# EAGLE design schematic_e01 (EAGLE 5.09)
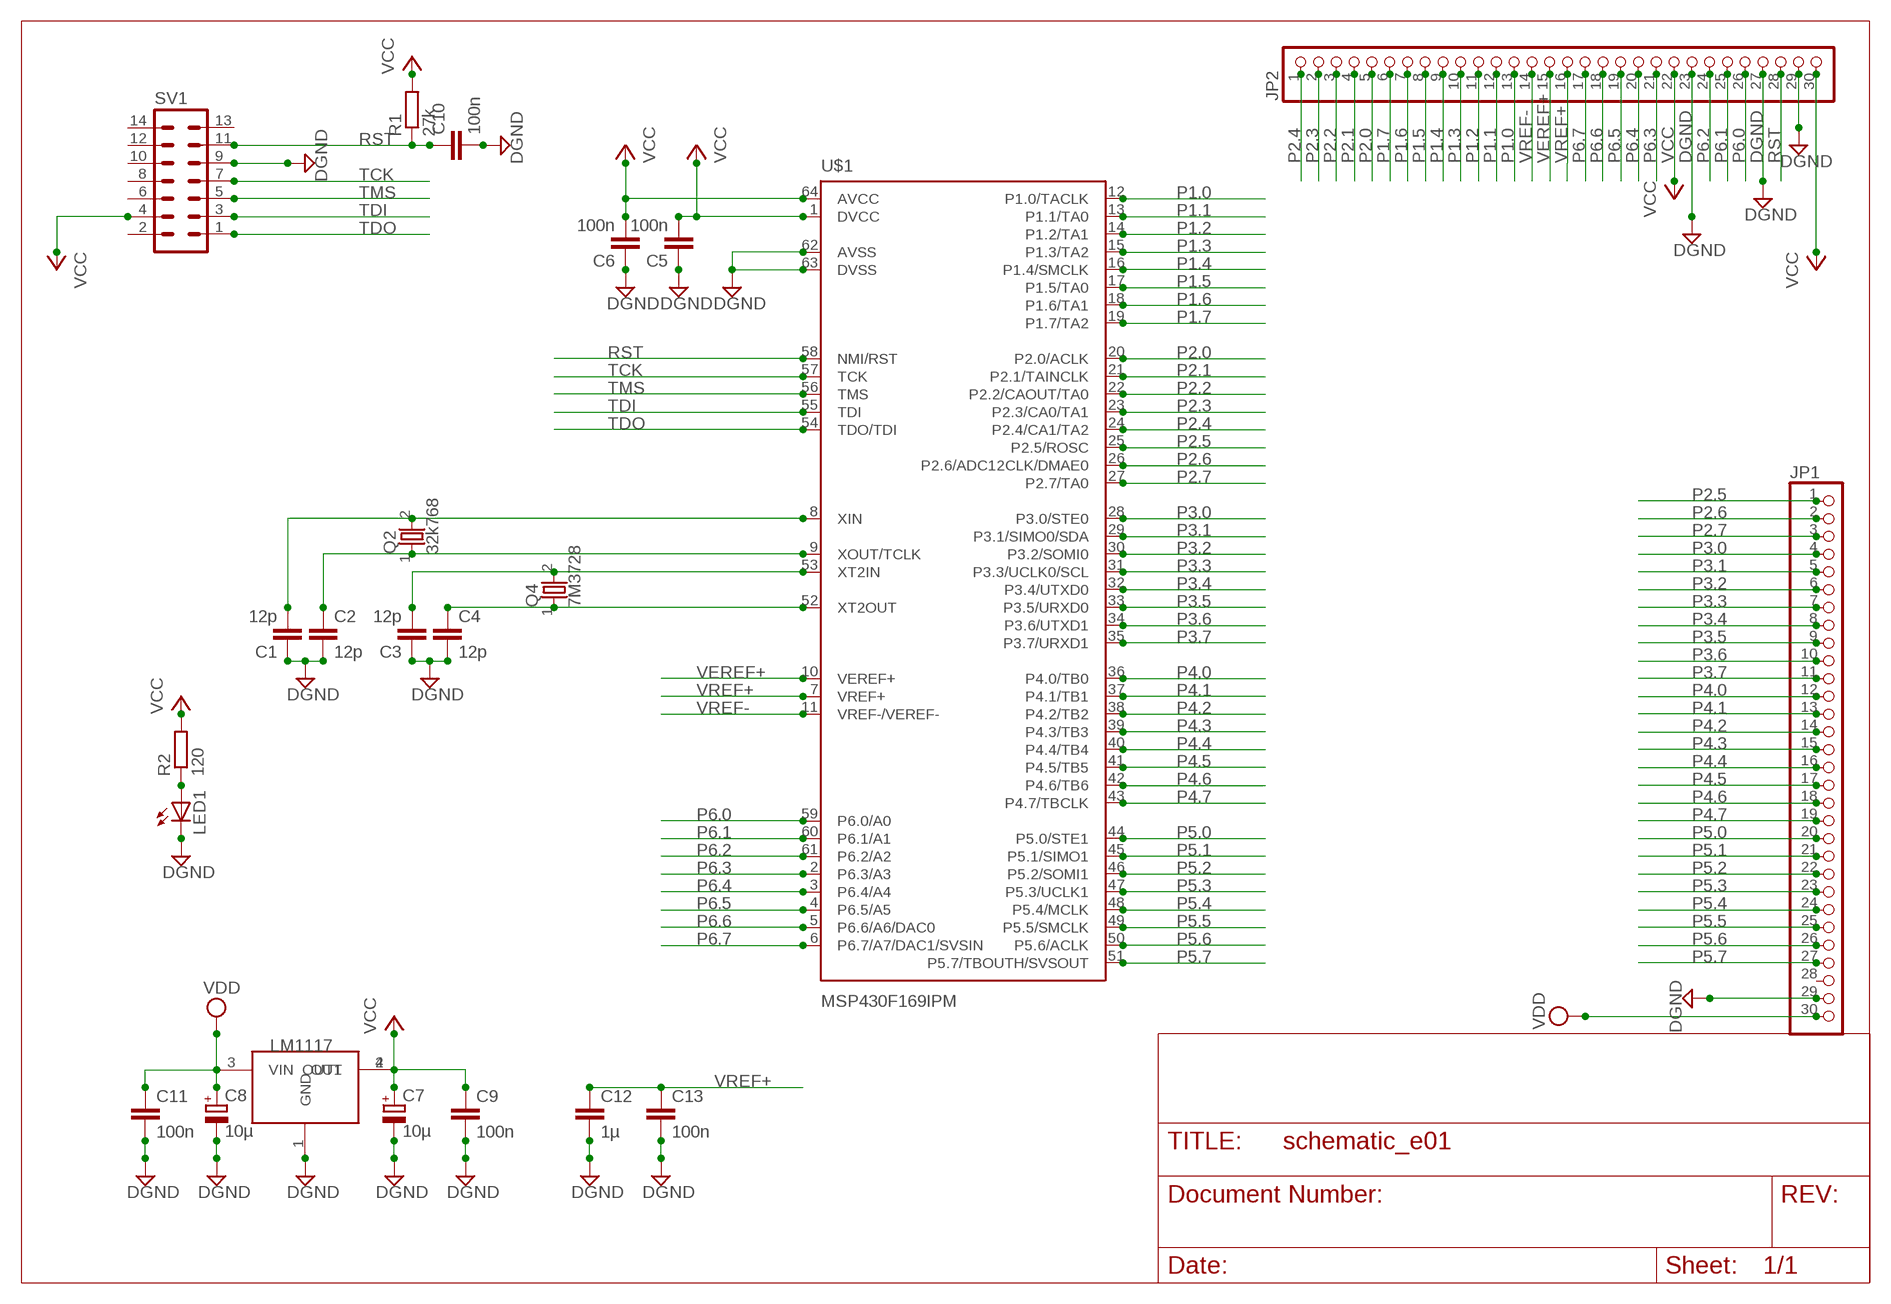
[diagram p0: schematic, sheet 1]

## Parts
C1  12p  C-EUC0805  [C0805]
C2  12p  C-EUC0805  [C0805]
C3  12p  C-EUC0805  [C0805]
C4  12p  C-EUC0805  [C0805]
C5  100n  C-EUC0805  [C0805]
C6  100n  C-EUC0805  [C0805]
C7  10µ  CPOL-EU153CLV-0505  [153CLV-0505]
C8  10µ  CPOL-EU153CLV-0505  [153CLV-0505]
C9  100n  C-EUC0805  [C0805]
C10  100n  C-EUC0805  [C0805]
C11  100n  C-EUC0805  [C0805]
C12  1µ  C-EUC0805  [C0805]
C13  100n  C-EUC0805  [C0805]
IC1  LM1117  [SOT223]
JP1  PINHD-1X30  [1X30]
JP2  PINHD-1X30  [1X30]
LED1  LEDP-LCC-2  [P-LCC-2]
Q2  32k768  MC406  [MC406]
Q4  7M3728  FA-365  [FA-365]
R1  27k  R-EU_R1206  [R1206]
R2  120  R-EU_R0805  [R0805]
SV1  ML14  [ML14]
U$1  MSP430F169IPM  [S-PQFP64-G64]

## Nets
DGND: C1.1 C2.2 C3.1 C4.2 C5.1 C6.1 C7.- C8.- C9.2 C10.2 C11.2 C12.2 C13.2 IC1.1(GND) JP1.29 JP2.23 JP2.27 JP2.29 LED1.C SV1.9 U$1.62(AVSS) U$1.63(DVSS)
N$1: C1.2 Q2.2 U$1.8(XIN)
N$2: C2.1 Q2.1 U$1.9(XOUT/TCLK)
N$3: C3.2 Q4.2 U$1.53(XT2IN)
N$4: C4.1 Q4.1 U$1.52(XT2OUT)
N$6: LED1.A R2.1
P1.0: JP2.13 U$1.12(P1.0/TACLK)
P1.1: JP2.12 U$1.13(P1.1/TA0)
P1.2: JP2.11 U$1.14(P1.2/TA1)
P1.3: JP2.10 U$1.15(P1.3/TA2)
P1.4: JP2.9 U$1.16(P1.4/SMCLK)
P1.5: JP2.8 U$1.17(P1.5/TA0)
P1.6: JP2.7 U$1.18(P1.6/TA1)
P1.7: JP2.6 U$1.19(P1.7/TA2)
P2.0: JP2.5 U$1.20(P2.0/ACLK)
P2.1: JP2.4 U$1.21(P2.1/TAINCLK)
P2.2: JP2.3 U$1.22(P2.2/CAOUT/TA0)
P2.3: JP2.2 U$1.23(P2.3/CA0/TA1)
P2.4: JP2.1 U$1.24(P2.4/CA1/TA2)
P2.5: JP1.1 U$1.25(P2.5/ROSC)
P2.6: JP1.2 U$1.26(P2.6/ADC12CLK/DMAE0)
P2.7: JP1.3 U$1.27(P2.7/TA0)
P3.0: JP1.4 U$1.28(P3.0/STE0)
P3.1: JP1.5 U$1.29(P3.1/SIMO0/SDA)
P3.2: JP1.6 U$1.30(P3.2/SOMI0)
P3.3: JP1.7 U$1.31(P3.3/UCLK0/SCL)
P3.4: JP1.8 U$1.32(P3.4/UTXD0)
P3.5: JP1.9 U$1.33(P3.5/URXD0)
P3.6: JP1.10 U$1.34(P3.6/UTXD1)
P3.7: JP1.11 U$1.35(P3.7/URXD1)
P4.0: JP1.12 U$1.36(P4.0/TB0)
P4.1: JP1.13 U$1.37(P4.1/TB1)
P4.2: JP1.14 U$1.38(P4.2/TB2)
P4.3: JP1.15 U$1.39(P4.3/TB3)
P4.4: JP1.16 U$1.40(P4.4/TB4)
P4.5: JP1.17 U$1.41(P4.5/TB5)
P4.6: JP1.18 U$1.42(P4.6/TB6)
P4.7: JP1.19 U$1.43(P4.7/TBCLK)
P5.0: JP1.20 U$1.44(P5.0/STE1)
P5.1: JP1.21 U$1.45(P5.1/SIMO1)
P5.2: JP1.22 U$1.46(P5.2/SOMI1)
P5.3: JP1.23 U$1.47(P5.3/UCLK1)
P5.4: JP1.24 U$1.48(P5.4/MCLK)
P5.5: JP1.25 U$1.49(P5.5/SMCLK)
P5.6: JP1.26 U$1.50(P5.6/ACLK)
P5.7: JP1.27 U$1.51(P5.7/TBOUTH/SVSOUT)
P6.0: JP2.26 U$1.59(P6.0/A0)
P6.1: JP2.25 U$1.60(P6.1/A1)
P6.2: JP2.24 U$1.61(P6.2/A2)
P6.3: JP2.21 U$1.2(P6.3/A3)
P6.4: JP2.20 U$1.3(P6.4/A4)
P6.5: JP2.19 U$1.4(P6.5/A5)
P6.6: JP2.18 U$1.5(P6.6/A6/DAC0)
P6.7: JP2.17 U$1.6(P6.7/A7/DAC1/SVSIN)
RST: C10.1 JP2.28 R1.1 SV1.11 U$1.58(NMI/RST)
TCK: SV1.7 U$1.57(TCK)
TDI: SV1.3 U$1.55(TDI)
TDO: SV1.1 U$1.54(TDO/TDI)
TMS: SV1.5 U$1.56(TMS)
VCC: C5.2 C6.2 C7.+ C9.1 IC1.2(OUT) IC1.4(OUT1) JP2.22 JP2.30 R1.2 R2.2 SV1.4 U$1.1(DVCC) U$1.64(AVCC)
VDD: C8.+ C11.1 IC1.3(VIN) JP1.30
VEREF+: JP2.15 U$1.10(VEREF+)
VREF+: C12.1 C13.1 JP2.16 U$1.7(VREF+)
VREF-: JP2.14 U$1.11(VREF-/VEREF-)
Unconnected: JP1.28 SV1.2 SV1.6 SV1.8 SV1.10 SV1.12 SV1.13 SV1.14

## Library data of the parts
C1-C6 C9-C13 = rcl:C-EU: CAPACITOR, European symbol
C7 C8 = rcl:CPOL-EU: POLARIZED CAPACITOR, European symbol
IC1 = national-2:LM1117
JP1 JP2 = pinhead:PINHD-1X30: PIN HEADER
LED1 = led:LED: LED OSRAM: - CHIPLED LG R971, LG N971, LY N971, LG Q971, LY Q971, LO R971, LY R971 LH N974, LH R974 LS Q976, LO Q976, LY Q976 LO Q996 - Hyper CHIPLED LW Q18S LB Q993, LB Q99A, LB R99A - SideLED LS A670, LO A670, LY A670, LG A670, LP A670 LB A673, LV A673, LT A673, LW A673 LH A674 LY A675 LS A676, LA A676, LO A676, LY A676, LW A676 LS A679, LY A679, LG A679 - Hyper Micro SIDELED® LS Y876, LA Y876, LO Y876, LY Y876 LT Y87S - SmartLED LW L88C, LW L88S LB L89C, LB L89S, LG L890 LS L89K, LO L89K, LY L89K LS L896, LA L896, LO L896, LY L896 - TOPLED LS T670, LO T670, LY T670, LG T670, LP T670 LSG T670, LSP T670, LSY T670, LOP T670, LYG T670 LG T671, LOG T671, LSG T671 LB T673, LV T673, LT T673, LW T673 LH T674 LS T676, LA T676, LO T676, LY T676, LB T676, LH T676, LSB T676, LW T676 LB T67C, LV T67C, LT T67C, LS T67K, LO T67K, LY T67K, LW E67C LS E67B, LA E67B, LO E67B, LY E67B, LB E67C, LV E67C, LT E67C LW T67C LS T679, LY T679, LG T679 LS T770, LO T770, LY T770, LG T770, LP T770 LB T773, LV T773, LT T773, LW T773 LH T774 LS E675, LA E675, LY E675, LS T675 LS T776, LA T776, LO T776, LY T776, LB T776 LHGB T686 LT T68C, LB T68C - Hyper Mini TOPLED® LB M676 - Mini TOPLED Santana® LG M470 LS M47K, LO M47K, LY M47K Source: http://www.osram.convergy.de LUXEON: - LUMILED® LXK2-PW12-R00, LXK2-PW12-S00, LXK2-PW14-U00, LXK2-PW14-V00 LXK2-PM12-R00, LXK2-PM12-S00, LXK2-PM14-U00 LXK2-PE12-Q00, LXK2-PE12-R00, LXK2-PE12-S00, LXK2-PE14-T00, LXK2-PE14-U00 LXK2-PB12-K00, LXK2-PB12-L00, LXK2-PB12-M00, LXK2-PB14-N00, LXK2-PB14-P00, LXK2-PB14-Q00 LXK2-PR12-L00, LXK2-PR12-M00, LXK2-PR14-Q00, LXK2-PR14-R00 LXK2-PD12-Q00, LXK2-PD12-R00, LXK2-PD12-S00 LXK2-PH12-R00, LXK2-PH12-S00 LXK2-PL12-P00, LXK2-PL12-Q00, LXK2-PL12-R00 Source: www.luxeon.com KINGBRIGHT: KA-3528ASYC Source: www.kingbright.com
Q2 = crystal-epson:MC406
Q4 = extra_dev:FA-365
R1 R2 = rcl:R-EU_: RESISTOR, European symbol
SV1 = con-harting-ml:ML14: HARTING
U$1 = msp430:MSP430F16*: Mixed Signal Microcontroller 12bit ADC, 12bit DAC, I²C, USART, no LCD

## Net classes
0 default: clearance 0.25 mm
1 1: clearance 0.25 mm
2 2: clearance 0.25 mm

## Board
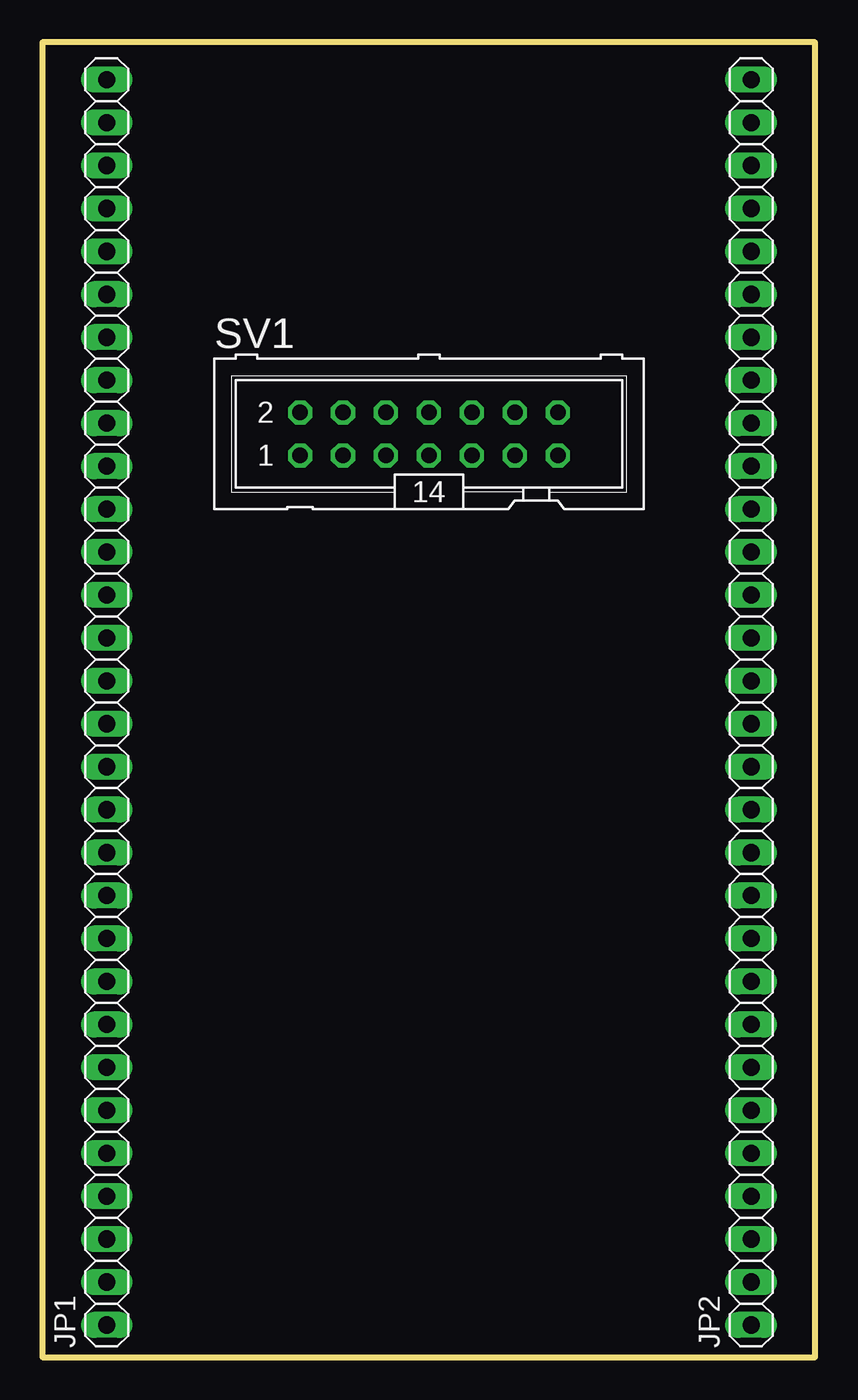
[diagram p1: board, top side]
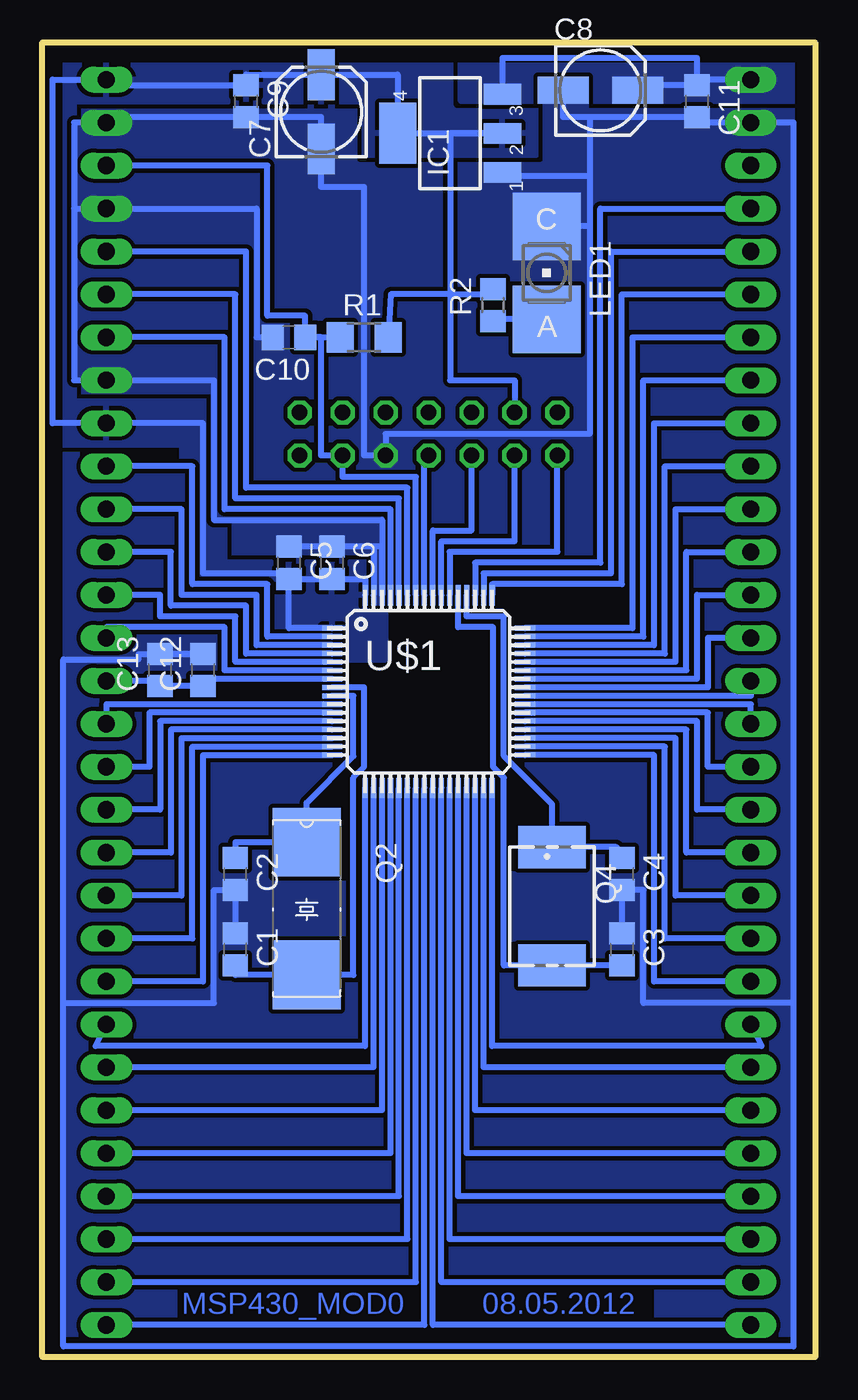
[diagram p2: board, bottom side, seen from below]

Size 45.7 x 77.78 mm. Coordinates in mm from the lower left corner, seen from the top.
Outline: 0,0 45.7,0 45.7,77.78 0,77.78 0,0
Copper layers (1*16): Top 0.035mm / dielectric 1.5mm / Bottom 0.035mm
Design rules "default": minimum track width 10mil, minimum drill 24mil, track to track 8mil, track to pad 8mil, pad to pad 8mil, via to via 8mil, smd to smd 8mil, copper to edge 40mil, drill to drill 8mil, minimum pad ring 10mil, minimum via ring 8mil, stop-mask expansion 4mil, vias tented up to drill 0mil, thermal gap 10mil

### Footprints (pad centres in the part's own frame; a part is rotated, then mirrored left to right if it is on the bottom)
C0805 = smd 1.3 x 1.5: 1 -0.95,0; 2 0.95,0
153CLV-0505 = smd 3 x 1.6: + 2.2,0; - -2.2,0
SOT223 = smd 1.219 x 2.235: 1 -2.311,-3.099; 2 0,-3.099; 3 2.311,-3.099 | smd 3.6 x 2.2: 4 0,3.099
1X30 = drill 1.016 long: 1 -36.83,0; 2 -34.29,0; 3 -31.75,0; 4 -29.21,0; 5 -26.67,0; 6 -24.13,0; 7 -21.59,0; 8 -19.05,0; 9 -16.51,0; 10 -13.97,0; 11 -11.43,0; 12 -8.89,0; 13 -6.35,0; 14 -3.81,0; 15 -1.27,0; 16 1.27,0; 17 3.81,0; 18 6.35,0; 19 8.89,0; 20 11.43,0; 21 13.97,0; 22 16.51,0; 23 19.05,0; 24 21.59,0; 25 24.13,0; 26 26.67,0; 27 29.21,0; 28 31.75,0; 29 34.29,0; 30 36.83,0
P-LCC-2 = smd 4 x 4: A 0,2.75; C 0,-2.75
MC406 = smd 4.064 x 4: 1 1.289,2; 2 9.138,2
FA-365 = smd 2.5 x 4: 1 -3.5,0; 2 3.5,0
R1206 = smd 1.6 x 1.803: 1 -1.422,0; 2 1.422,0
R0805 = smd 1.3 x 1.5: 1 -0.95,0; 2 0.95,0
ML14 = drill 0.914 octagon: 1 -7.62,-1.27; 2 -7.62,1.27; 3 -5.08,-1.27; 4 -5.08,1.27; 5 -2.54,-1.27; 6 -2.54,1.27; 7 0,-1.27; 8 0,1.27; 9 2.54,-1.27; 10 2.54,1.27; 11 5.08,-1.27; 12 5.08,1.27; 13 7.62,-1.27; 14 7.62,1.27
S-PQFP64-G64 = smd 1.2 x 0.3: 1 -5.7,3.75; 2 -5.7,3.25; 3 -5.7,2.75; 4 -5.7,2.25; 5 -5.7,1.75; 6 -5.7,1.25; 7 -5.7,0.75; 8 -5.7,0.25; 9 -5.7,-0.25; 10 -5.7,-0.75; 11 -5.7,-1.25; 12 -5.7,-1.75; 13 -5.7,-2.25; 14 -5.7,-2.75; 15 -5.7,-3.25; 16 -5.7,-3.75; 33 5.7,-3.75; 34 5.7,-3.25; 35 5.7,-2.75; 36 5.7,-2.25; 37 5.7,-1.75; 38 5.7,-1.25; 39 5.7,-0.75; 40 5.7,-0.25; 41 5.7,0.25; 42 5.7,0.75; 43 5.7,1.25; 44 5.7,1.75; 45 5.7,2.25; 46 5.7,2.75; 47 5.7,3.25; 48 5.7,3.75 | smd 0.3 x 1.2: 17 -3.75,-5.7; 18 -3.25,-5.7; 19 -2.75,-5.7; 20 -2.25,-5.7; 21 -1.75,-5.7; 22 -1.25,-5.7; 23 -0.75,-5.7; 24 -0.25,-5.7; 25 0.25,-5.7; 26 0.75,-5.7; 27 1.25,-5.7; 28 1.75,-5.7; 29 2.25,-5.7; 30 2.75,-5.7; 31 3.25,-5.7; 32 3.75,-5.7; 49 3.75,5.7; 50 3.25,5.7; 51 2.75,5.7; 52 2.25,5.7; 53 1.75,5.7; 54 1.25,5.7; 55 0.75,5.7; 56 0.25,5.7; 57 -0.25,5.7; 58 -0.75,5.7; 59 -1.25,5.7; 60 -1.75,5.7; 61 -2.25,5.7; 62 -2.75,5.7; 63 -3.25,5.7; 64 -3.75,5.7

### Placement (x,y rotation side)
C1  34.29,24.13 270 bottom
C2  34.29,28.57 270 bottom
C3  11.43,24.13 270 bottom
C4  11.43,28.57 270 bottom
C5  31.11,46.99 270 bottom
C6  28.57,46.99 270 bottom
C7  29.21,73.66 90 bottom
C8  12.7,74.93 0 bottom
C9  33.66,74.3 270 bottom
C10  31.11,60.33 180 bottom
C11  6.99,74.3 270 bottom
C12  36.2,40.64 90 bottom
C13  38.73,40.64 90 bottom
IC1  21.59,72.39 90 bottom
JP1  3.81,38.73 90 top
JP2  41.91,38.73 90 top
LED1  15.88,64.14 180 bottom
Q2  32.07,31.75 270 bottom
Q4  15.56,26.67 270 bottom
R1  26.67,60.33 0 bottom
R2  19.05,62.23 90 bottom
SV1  22.86,54.61 0 top
U$1  22.86,39.37 0 bottom

### Tracks (layer width: path | path; a pad name or v marks a point on that pad's centre or on a via)
DGND
  Bottom 0.35: C1.1 C2.2 35.56,27.62 35.56,20.95 44.45,20.95 | C3.1 C4.2 10.16,27.62 10.16,20.95 1.27,20.95 | 26.11,47.94 U$1.63 | 26.11,47.94 C6.1 C5.1 | 26.11,47.94 25.61,47.94 U$1.62 25.61,49.53 35.56,49.53 35.56,57.78 JP2.23 43.81,57.78 43.81,67.94 | 44.45,20.95 44.45,0.64 1.27,0.64 1.27,20.95 | C10.2 33.02,60.33 33.02,67.94 JP2.27 43.81,67.94 | IC1.1 18.49,69.85 13.34,69.85 | 43.81,67.94 43.81,73.03 JP2.29 41.91,73.34 C9.2 29.21,73.34 C7.- 29.21,69.22 26.67,69.22 26.67,53.34 SV1.9 25.4,54.61 13.34,54.61 13.34,66.89 | 1.27,20.95 1.27,73.03 JP1.29 6.99,73.03 C11.2 13.34,73.34 | 13.34,73.34 14.9,73.34 C8.- | 13.34,73.34 13.34,69.85 | C13.2 C12.2 40.01,41.59 40.01,41.27 44.45,41.27 44.45,20.95 | 13.34,69.85 13.34,66.89 | 13.34,66.89 LED1.C
  pour Bottom (isolate 0.001, rank 3, no thermals): 0,77.47 0,0 45.72,0 45.72,77.47
N$1
  Bottom 0.35: U$1.8 26.67,39.62 26.67,34.92 27.3,34.29 27.3,22.61 Q2.2 34.29,22.61 C1.2
N$2
  Bottom 0.35: U$1.9 27.3,39.12 27.3,35.56 30.07,32.8 Q2.1 34.29,30.46 C2.1
N$3
  Bottom 0.35: U$1.53 21.11,43.18 19.05,43.18 19.05,34.92 18.41,34.29 18.41,23.17 Q4.2 C3.2
N$4
  Bottom 0.35: U$1.52 20.61,43.81 18.41,43.81 18.41,35.56 15.56,32.7 Q4.1 11.76,30.17 11.43,29.84 C4.1
N$6
  Bottom 0.35: 15.56,62.66 LED1.A 19.05,61.38 R2.1
P1.0
  Bottom 0.35: U$1.12 38.73,37.62 38.73,32.38 JP2.13
P1.1
  Bottom 0.35: U$1.13 38.1,37.12 38.1,29.84 JP2.12
P1.2
  Bottom 0.35: U$1.14 37.47,36.62 37.47,27.3 JP2.11
P1.3
  Bottom 0.35: U$1.15 36.83,36.12 36.83,24.77 JP2.10
P1.4
  Bottom 0.35: U$1.16 36.2,35.62 36.2,22.23 JP2.9
P1.5
  Bottom 0.35: U$1.17 26.61,18.41 42.55,18.41 JP2.8
P1.6
  Bottom 0.35: U$1.18 26.11,17.14 JP2.7
P1.7
  Bottom 0.35: U$1.19 25.61,14.61 JP2.6
P2.0
  Bottom 0.35: U$1.20 25.11,12.06 JP2.5
P2.1
  Bottom 0.35: U$1.21 24.61,9.53 JP2.4
P2.2
  Bottom 0.35: U$1.22 24.11,6.99 JP2.3
P2.3
  Bottom 0.35: U$1.23 23.61,4.45 JP2.2
P2.4
  Bottom 0.35: U$1.24 23.11,1.91 JP2.1
P2.5
  Bottom 0.35: U$1.25 22.61,1.91 JP1.1
P2.6
  Bottom 0.35: U$1.26 22.11,4.45 JP1.2
P2.7
  Bottom 0.35: U$1.27 21.61,6.99 JP1.3
P3.0
  Bottom 0.35: U$1.28 21.11,9.53 JP1.4
P3.1
  Bottom 0.35: U$1.29 20.61,12.06 JP1.5
P3.2
  Bottom 0.35: U$1.30 20.11,14.61 JP1.6
P3.3
  Bottom 0.35: U$1.31 19.61,17.14 JP1.7
P3.4
  Bottom 0.35: U$1.32 19.11,18.41 3.17,18.41 JP1.8
P3.5
  Bottom 0.35: U$1.33 9.53,35.62 9.53,22.23 JP1.9
P3.6
  Bottom 0.35: U$1.34 8.89,36.12 8.89,24.77 JP1.10
P3.7
  Bottom 0.35: U$1.35 8.26,36.62 8.26,27.3 JP1.11
P4.0
  Bottom 0.35: U$1.36 7.62,37.12 7.62,29.84 JP1.12
P4.1
  Bottom 0.35: U$1.37 6.99,37.62 6.99,32.38 JP1.13
P4.2
  Bottom 0.35: U$1.38 6.35,38.12 6.35,34.92 JP1.14
P4.3
  Bottom 0.35: U$1.39 3.81,38.62 JP1.15
P4.4
  Bottom 0.35: U$1.40 3.81,39.12 JP1.16
P4.5
  Bottom 0.35: U$1.41 6.35,39.62 6.35,42.55 JP1.17
P4.6
  Bottom 0.35: U$1.42 6.99,40.12 6.99,45.09 JP1.18
P4.7
  Bottom 0.35: U$1.43 7.62,40.62 7.62,47.62 JP1.19
P5.0
  Bottom 0.35: U$1.44 8.26,41.12 8.26,50.16 JP1.20
P5.1
  Bottom 0.35: U$1.45 8.89,41.62 8.89,52.7 JP1.21
P5.2
  Bottom 0.35: U$1.46 9.53,42.12 9.53,55.24 JP1.22
P5.3
  Bottom 0.35: U$1.47 10.16,42.62 10.16,57.78 JP1.23
P5.4
  Bottom 0.35: U$1.48 10.79,43.12 10.79,60.33 JP1.24
P5.5
  Bottom 0.35: U$1.49 19.11,45.72 11.43,45.72 11.43,62.87 JP1.25
P5.6
  Bottom 0.35: U$1.50 19.61,46.35 12.06,46.35 12.06,65.41 JP1.26
P5.7
  Bottom 0.35: U$1.51 20.11,46.99 12.7,46.99 12.7,67.94 JP1.27
P6.0
  Bottom 0.35: U$1.59 24.11,51.44 33.66,51.44 33.66,65.41 JP2.26
P6.1
  Bottom 0.35: U$1.60 24.61,50.8 34.29,50.8 34.29,62.87 JP2.25
P6.2
  Bottom 0.35: U$1.61 25.11,50.16 34.92,50.16 34.92,60.33 JP2.24
P6.3
  Bottom 0.35: JP2.21 36.83,52.7 36.83,45.72 32.38,45.72 32.38,42.62 U$1.2
P6.4
  Bottom 0.35: JP2.20 37.47,50.16 37.47,45.09 33.02,45.09 33.02,42.12 U$1.3
P6.5
  Bottom 0.35: JP2.19 38.1,47.62 38.1,44.45 33.66,44.45 33.66,41.62 U$1.4
P6.6
  Bottom 0.35: JP2.18 38.73,45.09 38.73,43.81 34.29,43.81 34.29,41.12 U$1.5
P6.7
  Bottom 0.35: U$1.6 34.92,40.62 34.92,43.18 41.91,43.18 JP2.17
RST
  Bottom 0.35: C10.1 29.21,60.33 29.21,53.34 SV1.11 27.94,52.07 23.61,52.07 U$1.58 | C10.1 30.16,61.59 32.38,61.59 32.38,70.48 JP2.28 | C10.1 R1.1
TCK
  Bottom 0.35: U$1.57 23.11,53.34 SV1.7
TDI
  Bottom 0.35: U$1.55 22.11,48.26 17.78,48.26 SV1.3
TDO
  Bottom 0.35: U$1.54 21.61,47.62 15.24,47.62 SV1.1
TMS
  Bottom 0.35: U$1.56 22.61,48.9 20.32,48.9 SV1.5
VCC
  Bottom 0.35: U$1.1 31.11,43.12 C5.2 | U$1.64 26.61,46.04 C6.2 C5.2 | 21.59,62.87 21.59,72.39 IC1.2 IC1.4 24.69,75.86 C7.+ 33.66,75.86 C9.1 41.91,75.25 JP2.30 45.09,75.56 45.09,55.24 JP2.22 36.2,55.24 36.2,46.35 31.11,46.35 C5.2 | R1.2 25.09,62.87 21.59,62.87 | 21.59,62.87 21.59,57.78 17.78,57.78 SV1.4 | R2.2 19.05,62.87 21.59,62.87
  pour Bottom (rank 2): 16.51,74.3 20.95,74.3 20.95,77.47 45.72,77.47 45.72,53.98 37.47,53.98 37.47,41.27 25.4,41.27 25.4,46.99 34.92,46.99 34.92,56.52 43.81,56.52 43.81,74.3 26.67,74.3 26.67,71.12 16.51,71.12
VDD
  Bottom 0.35: JP1.30 6.99,75.56 C11.1 | IC1.3 18.49,76.83 6.99,76.83 C11.1 | C8.+ 10.5,75.25 C11.1
  pour Bottom (isolate 0.001, no thermals): 0,77.47 0,74.3 20.95,74.3 20.95,77.47
VEREF+
  Bottom 0.35: U$1.10 41.91,38.62 JP2.15
VREF+
  Bottom 0.35: U$1.7 36.2,40.12 C12.1 C13.1 38.73,40.01 JP2.16
VREF-
  Bottom 0.35: U$1.11 39.37,38.12 39.37,34.92 JP2.14

### Text on the board
Bottom: 08.05.2012 | MSP430_MOD0